# Altium schematic sheet 5_OSC_PLL_PMUIO.schdoc
size 431 x 309 mm; Symbol: Sheet-Symbol_A4; Device: Sheet-Symbol_A4; Company: 嘉立创EDA; Version: V1.0; Page Size: A4; @Project Name: RK3568核心板; @Page Count: 13; @Update Date: 2024-10-10; @Create Date: 2024-10-09; @Schematic Name: Schematic1; @Page No: 4; @Page Name: OSC/PLL/PMUIO; @Board Name: Board1; @Create Time: 15:26:55; @Update Time: 09:52:56; Width: 1655; Height: 1170; Region Start: 1; X Region Count: 6; Y Region Count: 4; Blade Width: 10; Title Block Position: 3
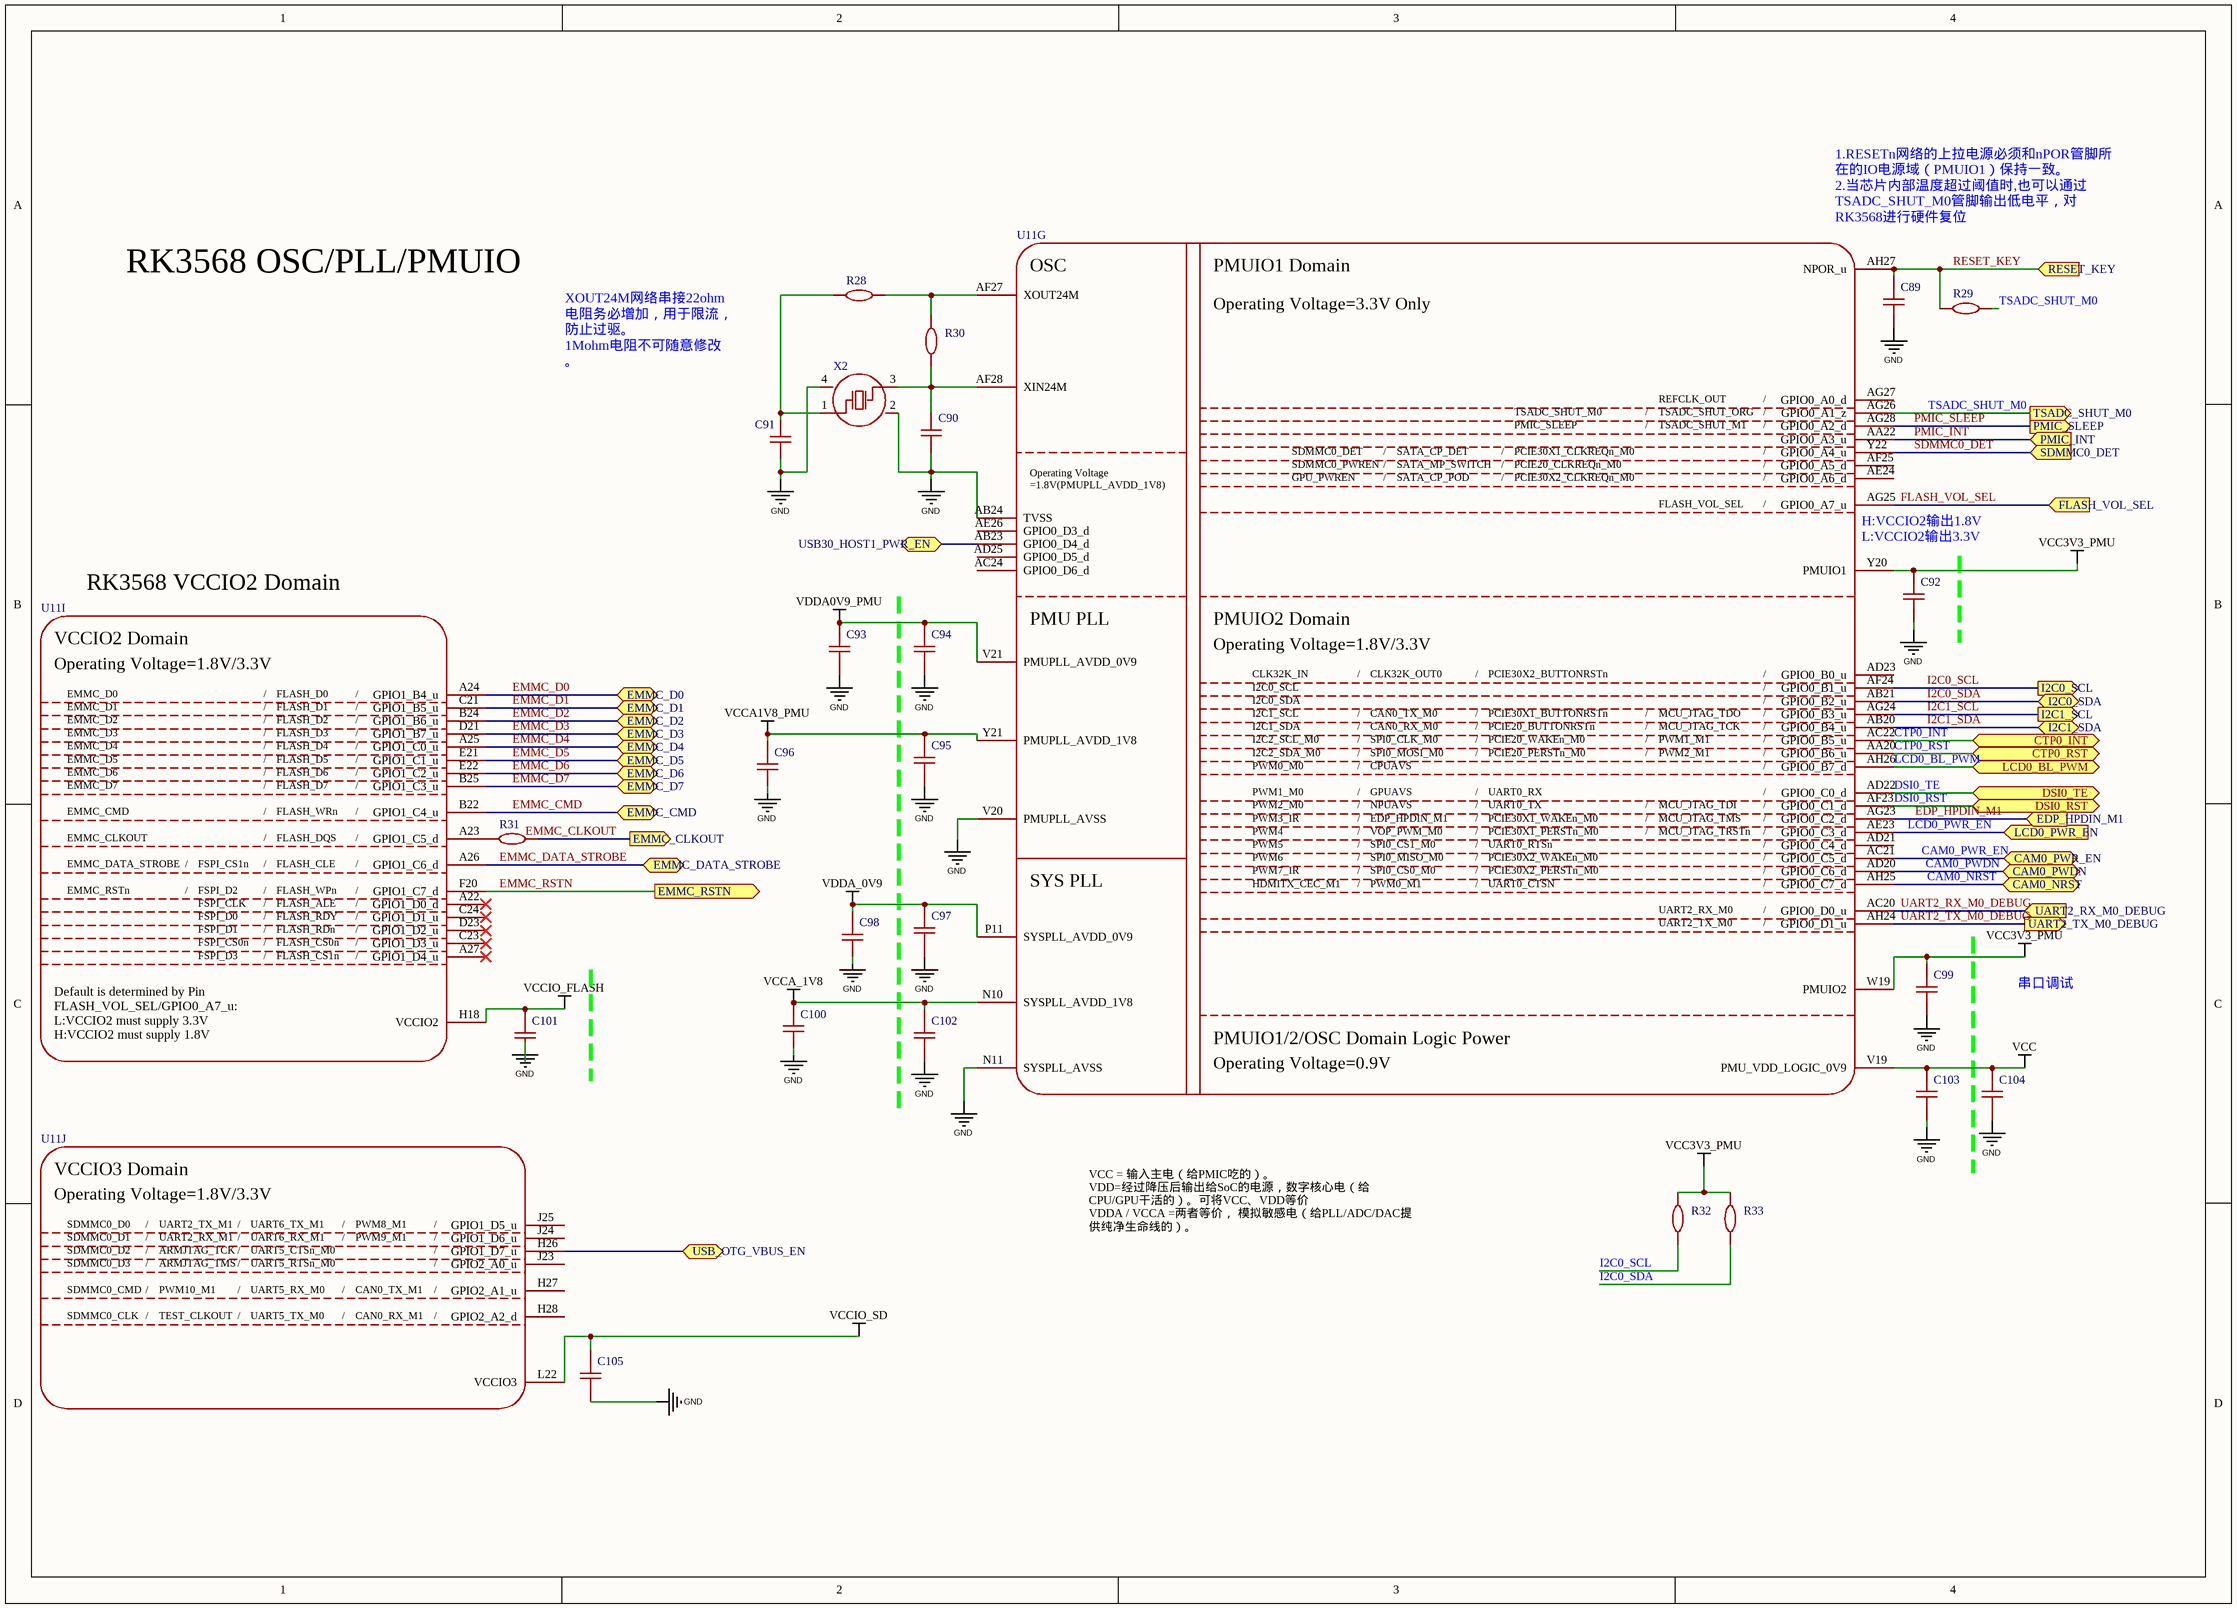
[diagram p0: 5_OSC_PLL_PMUIO.schdoc]

## Parts
C89  100nF  [C0201]  (value not drawn)
C90  12pF  [C0402]  (value not drawn)
C91  12pF  [C0402]  (value not drawn)
C92  100nF  [C0201]  (value not drawn)
C93  1uF  [C0402]  (value not drawn)
C94  100nF  [C0201]  (value not drawn)
C95  100nF  [C0201]  (value not drawn)
C96  1uF  [C0402]  (value not drawn)
C97  100nF  [C0201]  (value not drawn)
C98  1uF  [C0402]  (value not drawn)
C99  100nF  [C0201]  (value not drawn)
C100  1uF  [C0402]  (value not drawn)
C101  100nF  [C0201]  (value not drawn)
C102  100nF  [C0201]  (value not drawn)
C103  100nF  [C0201]  (value not drawn)
C104  1uF  [C0402]  (value not drawn)
C105  100nF  [C0201]  (value not drawn)
R28  22Ω  [R0402]  (value not drawn)
R29  0Ω  [R0402]  (value not drawn)
R30  1MΩ  [R0402]  (value not drawn)
R31  22Ω  [R0201]  (value not drawn)
R32  2.2kΩ  [R0402]  (value not drawn)
R33  2.2kΩ  [R0402]  (value not drawn)
U11  SOC_RK3568  [RK3568]  (value not drawn)  (parts G,I,J of 23)
X2  24MHz  [CRYSTAL-SMD_4P-L3.2-W2.5-BL]  (value not drawn)

## Ports
CAM0_NRST (bidir), CAM0_PWDN (bidir), CAM0_PWR_EN (bidir), CTP0_INT (bidir), CTP0_RST (bidir), DSI0_RST (bidir), DSI0_TE (bidir), EDP_HPDIN_M1 (in), EMMC_CLKOUT (out), EMMC_CMD (bidir), EMMC_D0 (bidir), EMMC_D1 (bidir), EMMC_D2 (bidir), EMMC_D3 (bidir), EMMC_D4 (bidir), EMMC_D5 (bidir), EMMC_D6 (bidir), EMMC_D7 (bidir), EMMC_DATA_STROBE (bidir), EMMC_RSTN (out), FLASH_VOL_SEL (in), I2C0_SCL (out), I2C0_SDA (bidir), I2C1_SCL (out), I2C1_SDA (bidir), LCD0_BL_PWM (bidir), LCD0_PWR_EN (in), PMIC_INT (in), PMIC_SLEEP (out), RESET_KEY (in), SDMMC0_DET (in), TSADC_SHUT_M0 (out), UART2_RX_M0_DEBUG (in), UART2_TX_M0_DEBUG (out), USB30_HOST1_PWR_EN (bidir), USB_OTG_VBUS_EN (bidir)

## Nets
GND: C89.1 C90.1 C91.1 C92.1 C93.1 C94.1 C95.1 C96.1 C97.1 C98.1 C99.1 C100.1 C101.1 C102.1 C103.1 C104.1 C105.1 U11.AB24(TVSS) U11.N11(SYSPLL_AVSS) U11.V20(PMUPLL_AVSS) X2.2(GND) X2.4(GND)
VCC: C103.2 C104.2 U11.V19(PMU_VDD_LOGIC_0V9)
VCC3V3_PMU: C92.2 C99.2 R32.2 R33.2 U11.W19(PMUIO2) U11.Y20(PMUIO1)
VCCA1V8_PMU: C95.2 C96.2 U11.Y21(PMUPLL_AVDD_1V8)
VCCA_1V8: C100.2 C102.2 U11.N10(SYSPLL_AVDD_1V8)
VCCIO_FLASH: C101.2 U11.H18(VCCIO2)
VCCIO_SD: C105.2 U11.L22(VCCIO3)
VDDA0V9_PMU: C93.2 C94.2 U11.V21(PMUPLL_AVDD_0V9)
VDDA_0V9: C97.2 C98.2 U11.P11(SYSPLL_AVDD_0V9)
CAM0_NRST: U11.AH25(GPIO0_C7_d) ; port CAM0_NRST
CAM0_PWDN: U11.AD20(GPIO0_C6_d) ; port CAM0_PWDN
CAM0_PWR_EN: U11.AC21(GPIO0_C5_d) ; port CAM0_PWR_EN
CTP0_INT: U11.AC22(GPIO0_B5_u) ; port CTP0_INT
CTP0_RST: U11.AA20(GPIO0_B6_u) ; port CTP0_RST
DSI0_RST: U11.AF23(GPIO0_C1_d) ; port DSI0_RST
DSI0_TE: U11.AD22(GPIO0_C0_d) ; port DSI0_TE
EDP_HPDIN_M1: U11.AG23(GPIO0_C2_d) ; port EDP_HPDIN_M1
EMMC_CLKOUT: R31.2 ; port EMMC_CLKOUT
EMMC_CMD: U11.B22(GPIO1_C4_u) ; port EMMC_CMD
EMMC_D0: U11.A24(GPIO1_B4_u) ; port EMMC_D0
EMMC_D1: U11.C21(GPIO1_B5_u) ; port EMMC_D1
EMMC_D2: U11.B24(GPIO1_B6_u) ; port EMMC_D2
EMMC_D3: U11.D21(GPIO1_B7_u) ; port EMMC_D3
EMMC_D4: U11.A25(GPIO1_C0_u) ; port EMMC_D4
EMMC_D5: U11.E21(GPIO1_C1_u) ; port EMMC_D5
EMMC_D6: U11.E22(GPIO1_C2_u) ; port EMMC_D6
EMMC_D7: U11.B25(GPIO1_C3_u) ; port EMMC_D7
EMMC_DATA_STROBE: U11.A26(GPIO1_C6_d) ; port EMMC_DATA_STROBE
EMMC_RSTN: U11.F20(GPIO1_C7_d) ; port EMMC_RSTN
FLASH_VOL_SEL: U11.AG25(GPIO0_A7_u) ; port FLASH_VOL_SEL
I2C0_SCL: R32.1 U11.AF24(GPIO0_B1_u) ; port I2C0_SCL
I2C0_SDA: R33.1 U11.AB21(GPIO0_B2_u) ; port I2C0_SDA
I2C1_SCL: U11.AG24(GPIO0_B3_u) ; port I2C1_SCL
I2C1_SDA: U11.AB20(GPIO0_B4_u) ; port I2C1_SDA
LCD0_BL_PWM: U11.AH26(GPIO0_B7_d) ; port LCD0_BL_PWM
LCD0_PWR_EN: U11.AE23(GPIO0_C3_d) ; port LCD0_PWR_EN
PMIC_INT: U11.AA22(GPIO0_A3_u) ; port PMIC_INT
PMIC_SLEEP: U11.AG28(GPIO0_A2_d) ; port PMIC_SLEEP
RESET_KEY: C89.2 R29.1 U11.AH27(NPOR_u) ; port RESET_KEY
SDMMC0_DET: U11.Y22(GPIO0_A4_u) ; port SDMMC0_DET
TSADC_SHUT_M0: R29.2 U11.AG26(GPIO0_A1_z) ; port TSADC_SHUT_M0
UART2_RX_M0_DEBUG: U11.AC20(GPIO0_D0_u) ; port UART2_RX_M0_DEBUG
UART2_TX_M0_DEBUG: U11.AH24(GPIO0_D1_u) ; port UART2_TX_M0_DEBUG
USB30_HOST1_PWR_EN: U11.AB23(GPIO0_D4_d) ; port USB30_HOST1_PWR_EN
USB_OTG_VBUS_EN: U11.H26(GPIO1_D7_u) ; port USB_OTG_VBUS_EN
NetC90_2: C90.2 R30.1 U11.AF28(XIN24M) X2.3(OSC2)
NetC91_2: C91.2 R28.1 X2.1(OSC1)
NetR28_2: R28.2 R30.2 U11.AF27(XOUT24M)
NetR31_1: R31.1 U11.A23(GPIO1_C5_d)

Not connected (* = marked no-connect by the designer): U11 A22(GPIO1_D0_d)* A27(GPIO1_D4_u)* AC24(GPIO0_D6_d) AD21(GPIO0_C4_d) AD23(GPIO0_B0_u) AD25(GPIO0_D5_d) AE24(GPIO0_A6_d) AE26(GPIO0_D3_d) AF25(GPIO0_A5_d) AG27(GPIO0_A0_d) C23(GPIO1_D3_u)* C24(GPIO1_D1_u)* D23(GPIO1_D2_u)* H27(GPIO2_A1_u) H28(GPIO2_A2_d) J23(GPIO2_A0_u) J24(GPIO1_D6_u) J25(GPIO1_D5_u)

## Notes on the sheet
- 1.RESETn网络的上拉电源必须和nPOR管脚所在的IO电源域（PMUIO1）保持一致。
  2.当芯片内部温度超过阈值时,也可以通过TSADC_SHUT_M0管脚输出低电平，对RK3568进行硬件复位
- RK3568 OSC/PLL/PMUIO
- XOUT24M网络串接22ohm电阻务必增加，用于限流，防止过驱。
  1Mohm电阻不可随意修改。
- (near U11) H:VCCIO2输出1.8V
  L:VCCIO2输出3.3V
- RK3568 VCCIO2 Domain
- 串口调试
- VCC = 输入主电（给PMIC吃的）。
  VDD=经过降压后输出给SoC的电源，数字核心电（给CPU/GPU干活的）。可将VCC、VDD等价
  VDDA / VCCA =两者等价， 模拟敏感电（给PLL/ADC/DAC提供纯净生命线的）。
- Labels drawn without touching a wire or pin: EMMC_CLKOUT
- 1
- 2
- 3
- 4
- 5
- 6
- A
- B
- C
- D
- 原理图
- Schematic1
- 创建日期
- 更新日期
- 2024-10-10
- 2024-10-09
- 审阅
- 绘制
- 图页
- OSC/PLL/PMUIO
- 物料编码
- RK3568核心板
- 版本
- 尺寸
- 页
- 共
- 13
- V1.0
- A4
- 嘉立创EDA
- (in symbol SOC_RK3568, part G) OSC; PMUIO1 Domain; Operating Voltage=3.3V Only; REFCLK_OUT; /; TSADC_SHUT_M0; TSADC_SHUT_ORG; PMIC_SLEEP; TSADC_SHUT_M1; SDMMC0_DET; SATA_CP_DET; PCIE30X1_CLKREQn_M0; SDMMC0_PWREN; SATA_MP_SWITCH; PCIE20_CLKREQn_M0; GPU_PWREN; SATA_CP_POD; PCIE30X2_CLKREQn_M0; FLASH_VOL_SEL; Operating Voltage / =1.8V(PMUPLL_AVDD_1V8); PMU PLL; PMUIO2 Domain; Operating Voltage=1.8V/3.3V; CLK32K_IN; CLK32K_OUT0; PCIE30X2_BUTTONRSTn; I2C0_SCL; I2C0_SDA; I2C1_SCL; CAN0_TX_M0; PCIE30X1_BUTTONRSTn; MCU_JTAG_TDO; I2C1_SDA; CAN0_RX_M0; PCIE20_BUTTONRSTn; MCU_JTAG_TCK; I2C2_SCL_M0; SPI0_CLK_M0; PCIE20_WAKEn_M0; PWM1_M1; I2C2_SDA_M0; SPI0_MOSI_M0; PCIE20_PERSTn_M0; PWM2_M1; PWM0_M0; CPUAVS; PWM1_M0; GPUAVS; UART0_RX; PWM2_M0; NPUAVS; UART0_TX; MCU_JTAG_TDI; PWM3_IR; EDP_HPDIN_M1; PCIE30X1_WAKEn_M0; MCU_JTAG_TMS; PWM4; VOP_PWM_M0; PCIE30X1_PERSTn_M0; MCU_JTAG_TRSTn; PWM5; SPI0_CS1_M0; UART0_RTSn; PWM6; SPI0_MISO_M0; PCIE30X2_WAKEn_M0; PWM7_IR; SPI0_CS0_M0; PCIE30X2_PERSTn_M0; HDMITX_CEC_M1; PWM0_M1; UART0_CTSN; SYS PLL; UART2_RX_M0; UART2_TX_M0; PMUIO1/2/OSC Domain Logic Power; Operating Voltage=0.9V
- (in symbol SOC_RK3568, part I) VCCIO2 Domain; Operating Voltage=1.8V/3.3V; EMMC_D0; /; FLASH_D0; EMMC_D1; FLASH_D1; EMMC_D2; FLASH_D2; EMMC_D3; FLASH_D3; EMMC_D4; FLASH_D4; EMMC_D5; FLASH_D5; EMMC_D6; FLASH_D6; EMMC_D7; FLASH_D7; EMMC_CMD; FLASH_WRn; EMMC_CLKOUT; FLASH_DQS; EMMC_DATA_STROBE; FSPI_CS1n; FLASH_CLE; EMMC_RSTn; FSPI_D2; FLASH_WPn; FSPI_CLK; FLASH_ALE; FSPI_D0; FLASH_RDY; FSPI_D1; FLASH_RDn; FSPI_CS0n; FLASH_CS0n; FSPI_D3; FLASH_CS1n; Default is determined by Pin / FLASH_VOL_SEL/GPIO0_A7_u: / L:VCCIO2 must supply 3.3V / H:VCCIO2 must supply 1.8V
- (in symbol SOC_RK3568, part J) VCCIO3 Domain; Operating Voltage=1.8V/3.3V; SDMMC0_D0; /; UART2_TX_M1; UART6_TX_M1; PWM8_M1; SDMMC0_D1; UART2_RX_M1; UART6_RX_M1; PWM9_M1; SDMMC0_D2; ARMJTAG_TCK; UART5_CTSn_M0; SDMMC0_D3; ARMJTAG_TMS; UART5_RTSn_M0; SDMMC0_CMD; PWM10_M1; UART5_RX_M0; CAN0_TX_M1; SDMMC0_CLK; TEST_CLKOUT; UART5_TX_M0; CAN0_RX_M1

## Library data of the parts
C89 C92 C94 C95 C97 C99 C101-C103 C105 = CL03A104KO3NNNC: 容值:100nF;精度:±10%;额定电压:16V;材质(温度系数):X5R;; Manufacturer: SAMSUNG(三星); Add into BOM: yes; Tolerance: ±10%; Voltage Rated: 16V; Temperature Coefficient: X5R; Symbol: CL03A104KO3NNNC; Device: CL03A104KO3NNNC; LCSC Part Name: 100nF ±10% 16V; Supplier Part: C307380; Manufacturer Part: CL03A104KO3NNNC; Supplier Footprint: 0201; JLCPCB Part Class: 扩展库; Datasheet: https://atta.szlcsc.com/upload/public/pdf/source/20160218/1457707763339.pdf; Supplier: LCSC; Convert to PCB: yes; Value: 100nF
C90 C91 = 0402CG120J500NT: 容值:12pF;精度:±5%;额定电压:50V;材质(温度系数):C0G;; Manufacturer: FH(风华); Add into BOM: yes; Tolerance: ±5%; Voltage Rated: 50V; Temperature Coefficient: C0G; Symbol: 0402CG120J500NT; Device: 0402CG120J500NT; LCSC Part Name: 12pF ±5% 50V; Supplier Part: C1547; Manufacturer Part: 0402CG120J500NT; Supplier Footprint: 0402; JLCPCB Part Class: 基础库; Datasheet: https://atta.szlcsc.com/upload/public/pdf/source/20200305/C486355_26A10D38EF8C2A5C37091D0039909270.pdf; Supplier: LCSC; Convert to PCB: yes; Value: 12pF
C93 C96 C98 C100 C104 = CL05A105KA5NQNC: 容值:1uF;精度:±10%;额定电压:25V;材质(温度系数):X5R;; Manufacturer: SAMSUNG(三星); Add into BOM: yes; Tolerance: ±10%; Voltage Rated: 25V; Temperature Coefficient: X5R; Symbol: CL05A105KA5NQNC; Device: CL05A105KA5NQNC; LCSC Part Name: 1uF ±10% 25V; Supplier Part: C52923; Manufacturer Part: CL05A105KA5NQNC; Supplier Footprint: 0402; JLCPCB Part Class: 基础库; Datasheet: https://atta.szlcsc.com/upload/public/pdf/source/20160218/1457707763339.pdf; Supplier: LCSC; Convert to PCB: yes; Value: 1uF
R28 = 0402WGF220JTCE: 电阻类型:厚膜电阻;阻值:22Ω;精度:±1%;功率:62.5mW;最大工作电压:50V;温度系数:±100ppm/℃;; Manufacturer: UNI-ROYAL(厚声); Add into BOM: yes; Tolerance: ±1%; Power(Watts): 62.5mW; Overload Voltage (Max): 50V; Symbol: 0402WGF220JTCE; Device: 0402WGF220JTCE; Supplier: LCSC; Manufacturer Part: 0402WGF220JTCE; Supplier Part: C25092; Value: 22Ω; JLCPCB Part Class: 基础库; LCSC Part Name: 22Ω ±1% 62.5mW 厚膜电阻; Supplier Footprint: 0402; Datasheet: https://atta.szlcsc.com/upload/public/pdf/source/20200306/C422600_1E6D84923E4A46A82E41ADD87F860B5C.pdf; Convert to PCB: yes; Type: 厚膜电阻; Temperature Coefficient: ±100ppm/℃; Operating Temperature Range: -55℃~+155℃
R29 = 0402WGF0000TCE: 电阻类型:厚膜电阻;阻值:0Ω;精度:±1%;功率:62.5mW;最大工作电压:50V;温度系数:±800ppm/℃;; Manufacturer: UNI-ROYAL(厚声); Add into BOM: yes; Tolerance: ±1%; Power(Watts): 62.5mW; Overload Voltage (Max): 50V; Symbol: 0402WGF0000TCE; Device: 0402WGF0000TCE; Supplier: LCSC; Manufacturer Part: 0402WGF0000TCE; Supplier Part: C17168; Value: 0Ω; JLCPCB Part Class: 基础库; LCSC Part Name: 0Ω ±1% 62.5mW 厚膜电阻; Supplier Footprint: 0402; Datasheet: https://atta.szlcsc.com/upload/public/pdf/source/20200306/C422600_1E6D84923E4A46A82E41ADD87F860B5C.pdf; Convert to PCB: yes; Type: 厚膜电阻; Temperature Coefficient: ±800ppm/℃; Operating Temperature Range: -55℃~+155℃
R30 = 0402WGF1004TCE: 电阻类型:厚膜电阻;阻值:1MΩ;精度:±1%;功率:62.5mW;最大工作电压:50V;温度系数:±100ppm/℃;; Manufacturer: UNI-ROYAL(厚声); Add into BOM: yes; Tolerance: ±1%; Power(Watts): 62.5mW; Overload Voltage (Max): 50V; Symbol: 0402WGF1004TCE; Device: 0402WGF1004TCE; Supplier: LCSC; Manufacturer Part: 0402WGF1004TCE; Supplier Part: C26083; Value: 1MΩ; JLCPCB Part Class: 基础库; LCSC Part Name: 1MΩ ±1% 62.5mW 厚膜电阻; Supplier Footprint: 0402; Datasheet: https://atta.szlcsc.com/upload/public/pdf/source/20200306/C422600_1E6D84923E4A46A82E41ADD87F860B5C.pdf; Convert to PCB: yes; Type: 厚膜电阻; Temperature Coefficient: ±100ppm/℃; Operating Temperature Range: -55℃~+155℃
R31 = 0201WMF220JTEE: 电阻类型:厚膜电阻;阻值:22Ω;精度:±1%;功率:50mW;最大工作电压:25V;温度系数:±200ppm/℃;; Manufacturer: UNI-ROYAL(厚声); Add into BOM: yes; Tolerance: ±1%; Power(Watts): 50mW; Overload Voltage (Max): 25V; Symbol: 0201WMF220JTEE; Device: 0201WMF220JTEE; Supplier: LCSC; Supplier Part: C270355; Manufacturer Part: 0201WMF220JTEE; Value: 22Ω; JLCPCB Part Class: 扩展库; LCSC Part Name: 22Ω ±1% 50mW 厚膜电阻; Supplier Footprint: 0201; Datasheet: https://atta.szlcsc.com/upload/public/pdf/source/20200306/C422600_1E6D84923E4A46A82E41ADD87F860B5C.pdf; Convert to PCB: yes; Type: 厚膜电阻; Temperature Coefficient: ±200ppm/℃; Operating Temperature Range: -55℃~+155℃
R32 R33 = 0402WGF2201TCE: 电阻类型:厚膜电阻;阻值:2.2kΩ;精度:±1%;功率:62.5mW;最大工作电压:50V;温度系数:±100ppm/℃;; Manufacturer: UNI-ROYAL(厚声); Add into BOM: yes; Tolerance: ±1%; Power(Watts): 62.5mW; Overload Voltage (Max): 50V; Symbol: 0402WGF2201TCE; Device: 0402WGF2201TCE; Supplier: LCSC; Manufacturer Part: 0402WGF2201TCE; Supplier Part: C25879; Value: 2.2kΩ; JLCPCB Part Class: 基础库; LCSC Part Name: 2.2kΩ ±1% 62.5mW 厚膜电阻; Supplier Footprint: 0402; Datasheet: https://atta.szlcsc.com/upload/public/pdf/source/20200306/C422600_1E6D84923E4A46A82E41ADD87F860B5C.pdf; Convert to PCB: yes; Type: 厚膜电阻; Temperature Coefficient: ±100ppm/℃; Operating Temperature Range: -55℃~+155℃
U11 = SOC_RK3568: Part Reference: U1000; Manufacturer: Rockchip (瑞芯微); PCB footprint: BGA636_19R00X19R00X1R20; SWAP_INFO: (S1+S2+S3+S4+S5+S6+S7+S8+S9+S10+S11+S12+S13+S14+S15+S16+S17+S18+S19+S20+S21+S22+S23); SPLIT_INST: TRUE; Value: RK3568; Priority: A; Add into BOM: yes; Relevance: []; Symbol: SOC_RK3568; Device: SOC_RK3568; RK PN: RK3568; Part Type: SOC; Manufacturer PN: RK3568; Created by: JJJ; Origin Footprint 2: BGA636_19R00X19R00X1R20; Convert to PCB: yes
X2 = X322524MOB4SI: 晶振类型:贴片晶振;频率:24MHz;常温频差:±10ppm;外接负载电容:12pF;频率稳定度(全温):±20ppm;; Manufacturer: YXC(扬兴晶振); Add into BOM: yes; Crystal Type: 贴片晶振; Normal temperature Frequency Tolerance: ±10ppm; External load capacitor: 12pF; Frequency Stability(Full temperature range): ±20ppm; Symbol: x322524mob4si; Device: X322524MOB4SI; LCSC Part Name: 24MHz ±10ppm 12pF; Supplier Part: C70590; Manufacturer Part: X322524MOB4SI; Supplier Footprint: SMD3225-4P; JLCPCB Part Class: 扩展库; Datasheet: https://atta.szlcsc.com/upload/public/pdf/source/20240329/19D5F850207469550BEB00D7DFEDBC7A.pdf; Supplier: LCSC; Convert to PCB: yes; Value: 24MHz; Operating Temperature: -40℃~+85℃